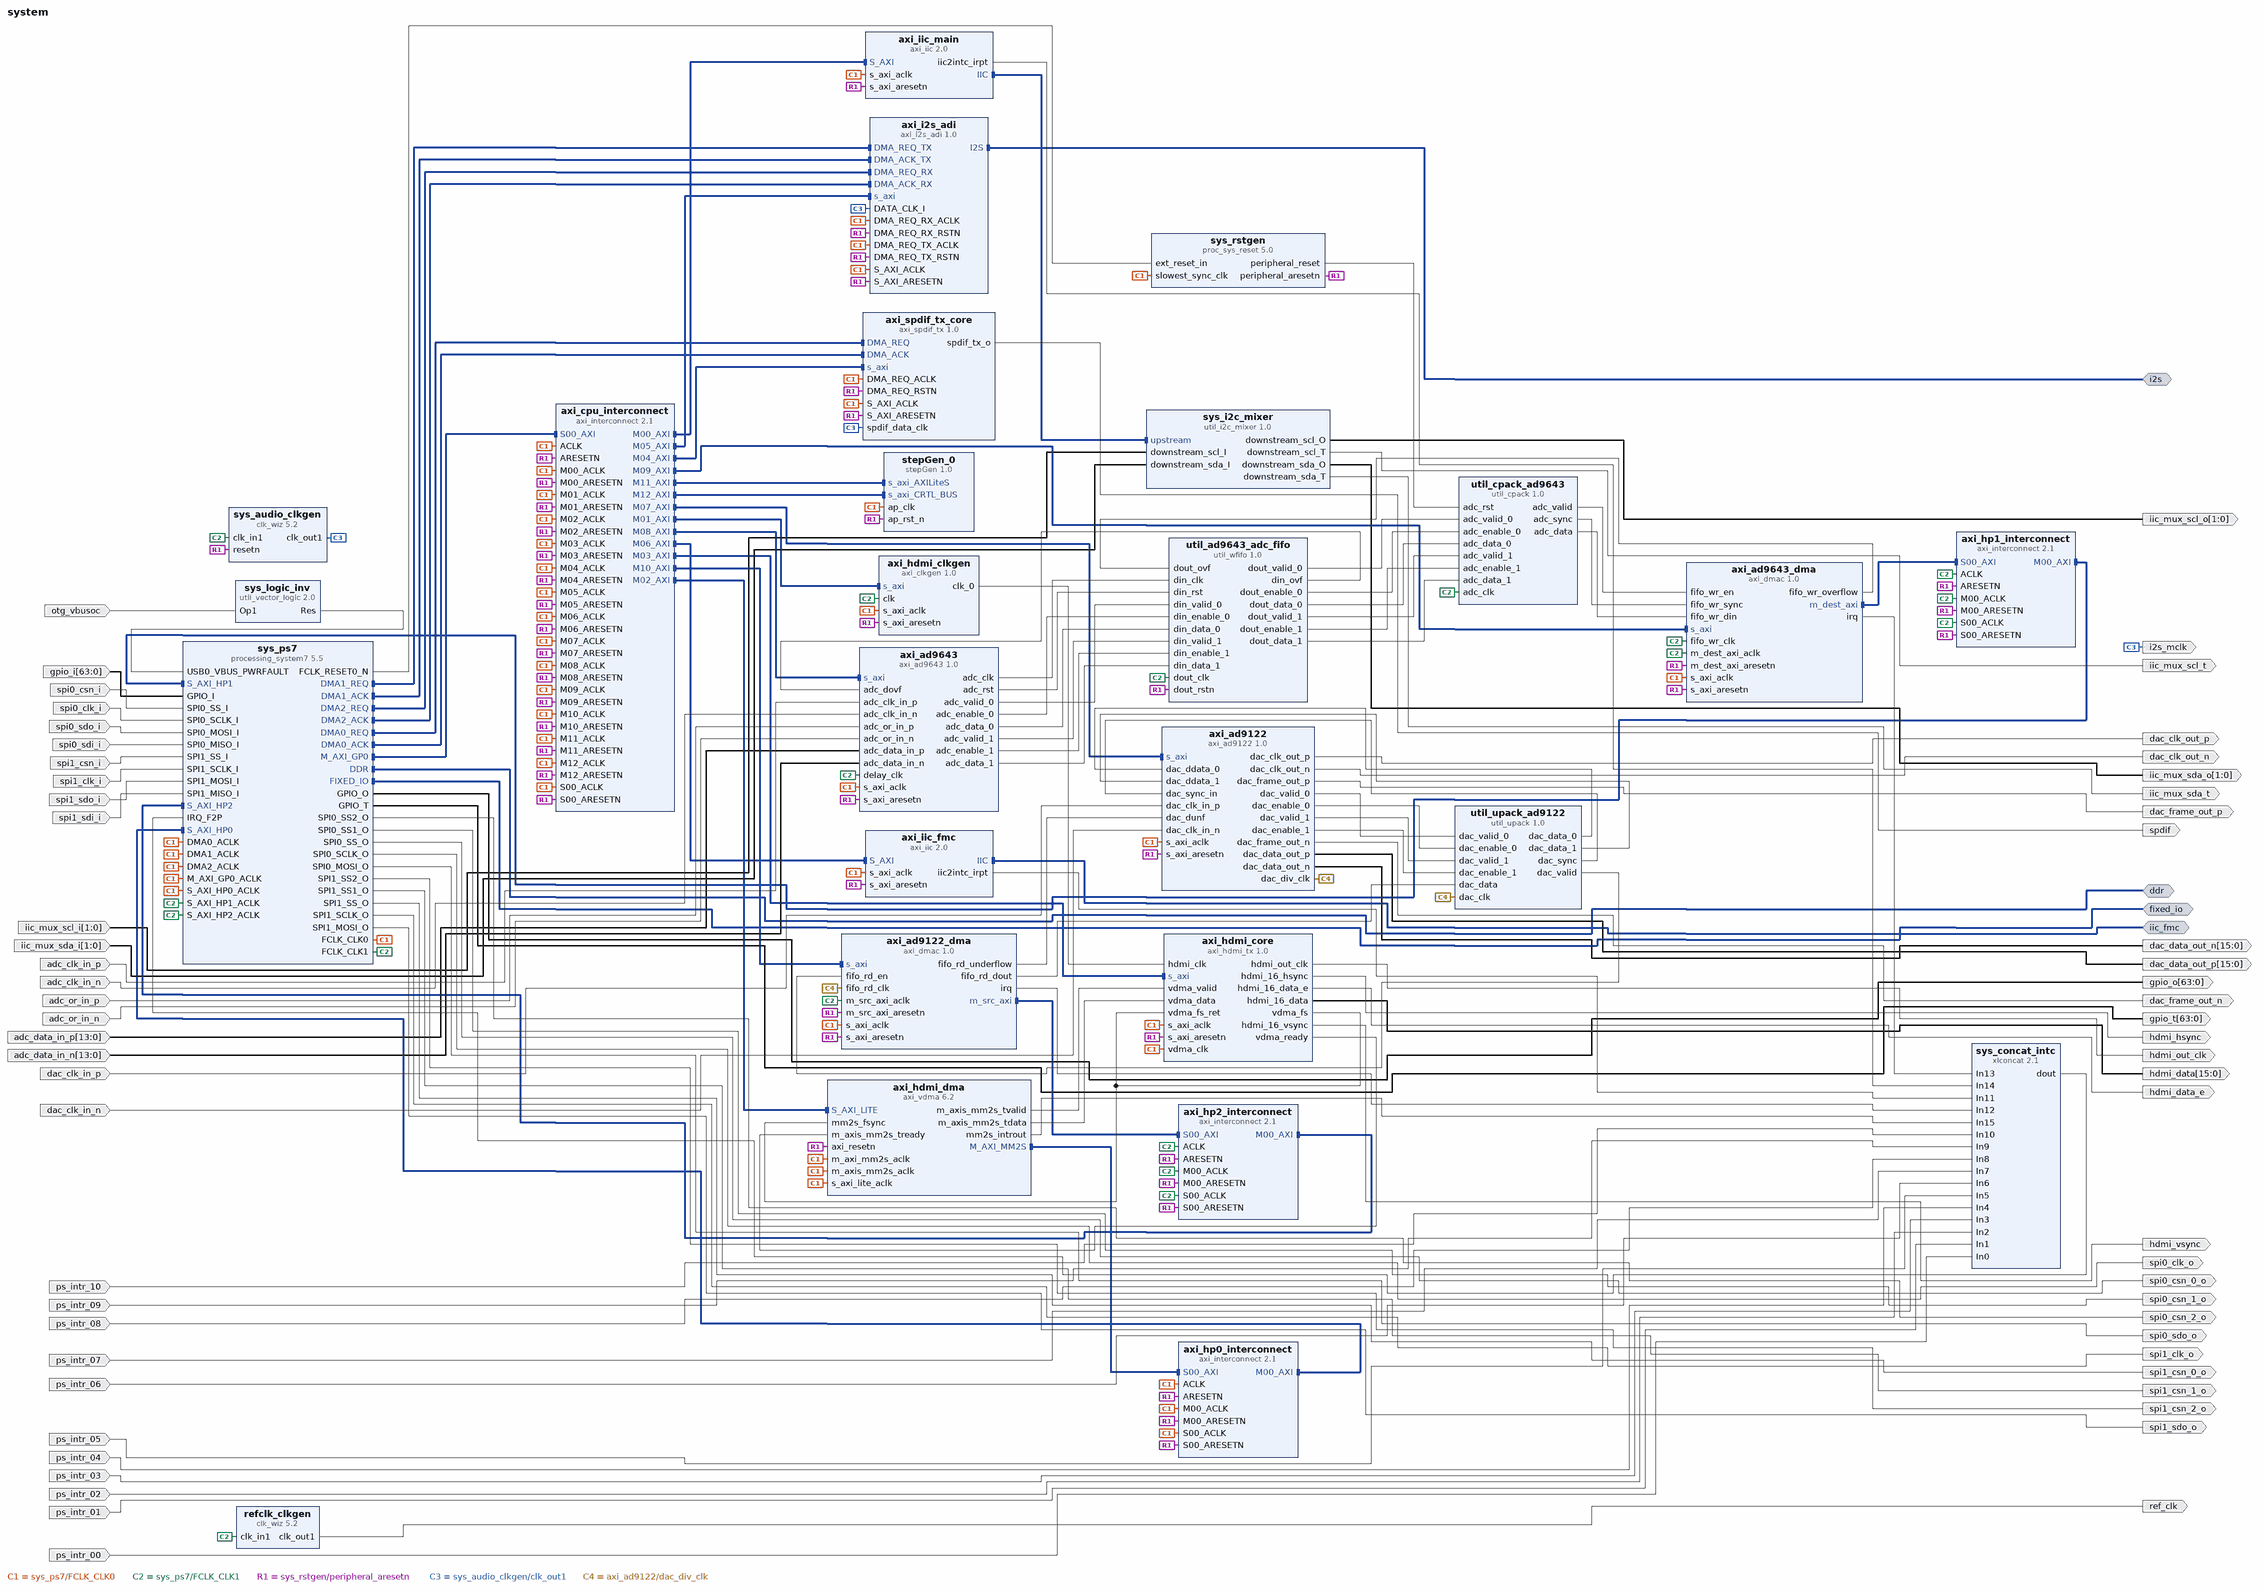
[diagram p0: block diagram of the top level]
# Vivado block design system, Vivado 2015.4.2
create_bd_design system

create_bd_intf_port -mode Master -vlnv xilinx.com:interface:ddrx_rtl:1.0 ddr
create_bd_intf_port -mode Master -vlnv xilinx.com:display_processing_system7:fixedio_rtl:1.0 fixed_io
create_bd_intf_port -mode Master -vlnv xilinx.com:interface:iic_rtl:1.0 iic_fmc
create_bd_intf_port -mode Master -vlnv analog.com:interface:i2s_rtl:1.0 i2s
create_bd_port -dir I -from 63 -to 0 gpio_i
create_bd_port -dir O -from 63 -to 0 gpio_o
create_bd_port -dir O -from 63 -to 0 gpio_t
create_bd_port -dir I -from 1 -to 0 iic_mux_scl_i
create_bd_port -dir O -from 1 -to 0 iic_mux_scl_o
create_bd_port -dir O iic_mux_scl_t
create_bd_port -dir I -from 1 -to 0 iic_mux_sda_i
create_bd_port -dir O -from 1 -to 0 iic_mux_sda_o
create_bd_port -dir O iic_mux_sda_t
create_bd_port -dir I otg_vbusoc
create_bd_port -dir O spi0_csn_2_o
create_bd_port -dir O spi0_csn_1_o
create_bd_port -dir O spi0_csn_0_o
create_bd_port -dir I spi0_csn_i
create_bd_port -dir I spi0_clk_i
create_bd_port -dir O spi0_clk_o
create_bd_port -dir I spi0_sdo_i
create_bd_port -dir O spi0_sdo_o
create_bd_port -dir I spi0_sdi_i
create_bd_port -dir O spi1_csn_2_o
create_bd_port -dir O spi1_csn_1_o
create_bd_port -dir O spi1_csn_0_o
create_bd_port -dir I spi1_csn_i
create_bd_port -dir I spi1_clk_i
create_bd_port -dir O spi1_clk_o
create_bd_port -dir I spi1_sdo_i
create_bd_port -dir O spi1_sdo_o
create_bd_port -dir I spi1_sdi_i
create_bd_port -dir O hdmi_out_clk
create_bd_port -dir O hdmi_hsync
create_bd_port -dir O hdmi_vsync
create_bd_port -dir O hdmi_data_e
create_bd_port -dir O -from 15 -to 0 hdmi_data
create_bd_port -dir O -type clk i2s_mclk
create_bd_port -dir O spdif
create_bd_port -dir I -type intr ps_intr_10
create_bd_port -dir I -type intr ps_intr_09
create_bd_port -dir I -type intr ps_intr_08
create_bd_port -dir I -type intr ps_intr_07
create_bd_port -dir I -type intr ps_intr_06
create_bd_port -dir I -type intr ps_intr_05
create_bd_port -dir I -type intr ps_intr_04
create_bd_port -dir I -type intr ps_intr_03
create_bd_port -dir I -type intr ps_intr_02
create_bd_port -dir I -type intr ps_intr_01
create_bd_port -dir I -type intr ps_intr_00
create_bd_port -dir O ref_clk
create_bd_port -dir I dac_clk_in_p
create_bd_port -dir I dac_clk_in_n
create_bd_port -dir O dac_clk_out_p
create_bd_port -dir O dac_clk_out_n
create_bd_port -dir O dac_frame_out_p
create_bd_port -dir O dac_frame_out_n
create_bd_port -dir O -from 15 -to 0 dac_data_out_p
create_bd_port -dir O -from 15 -to 0 dac_data_out_n
create_bd_port -dir I adc_clk_in_p
create_bd_port -dir I adc_clk_in_n
create_bd_port -dir I adc_or_in_p
create_bd_port -dir I adc_or_in_n
create_bd_port -dir I -from 13 -to 0 adc_data_in_p
create_bd_port -dir I -from 13 -to 0 adc_data_in_n

create_bd_cell -type ip -vlnv xilinx.com:ip:processing_system7:5.5 sys_ps7
set_property -dict [list \
  CONFIG.PCW_FPGA0_PERIPHERAL_FREQMHZ 100.0 \
  CONFIG.PCW_FPGA1_PERIPHERAL_FREQMHZ 200.0 \
  CONFIG.PCW_USE_S_AXI_HP0 1 \
  CONFIG.PCW_USE_S_AXI_HP1 1 \
  CONFIG.PCW_USE_S_AXI_HP2 1 \
  CONFIG.PCW_USE_DMA0 1 \
  CONFIG.PCW_USE_DMA1 1 \
  CONFIG.PCW_USE_DMA2 1 \
  CONFIG.PCW_USE_FABRIC_INTERRUPT 1 \
  CONFIG.PCW_EN_CLK1_PORT 1 \
  CONFIG.PCW_EN_RST1_PORT 1 \
  CONFIG.PCW_IRQ_F2P_INTR 1 \
  CONFIG.PCW_IRQ_F2P_MODE REVERSE \
  CONFIG.PCW_IMPORT_BOARD_PRESET ZedBoard \
  CONFIG.PCW_SPI0_PERIPHERAL_ENABLE 1 \
  CONFIG.PCW_SPI0_SPI0_IO EMIO \
  CONFIG.PCW_SPI1_PERIPHERAL_ENABLE 1 \
  CONFIG.PCW_SPI1_SPI1_IO EMIO \
  CONFIG.PCW_GPIO_EMIO_GPIO_ENABLE 1 \
  CONFIG.PCW_GPIO_EMIO_GPIO_IO 64 \
] [get_bd_cells sys_ps7]
# 1 more settings of sys_ps7 are not shown: defaults, MIO pin electricals, DDR timing, and values the tool derives
create_bd_cell -type ip -vlnv xilinx.com:ip:axi_iic:2.0 axi_iic_main
set_property -dict {CONFIG.USE_BOARD_FLOW true CONFIG.IIC_BOARD_INTERFACE Custom} [get_bd_cells axi_iic_main]
create_bd_cell -type ip -vlnv analog.com:user:util_i2c_mixer:1.0 sys_i2c_mixer
create_bd_cell -type ip -vlnv xilinx.com:ip:xlconcat:2.1 sys_concat_intc
set_property -dict {CONFIG.NUM_PORTS 16} [get_bd_cells sys_concat_intc]
create_bd_cell -type ip -vlnv xilinx.com:ip:proc_sys_reset:5.0 sys_rstgen
set_property -dict {CONFIG.C_EXT_RST_WIDTH 1} [get_bd_cells sys_rstgen]
create_bd_cell -type ip -vlnv xilinx.com:ip:util_vector_logic:2.0 sys_logic_inv
set_property -dict {CONFIG.C_SIZE 1 CONFIG.C_OPERATION not} [get_bd_cells sys_logic_inv]
create_bd_cell -type ip -vlnv analog.com:user:axi_clkgen:1.0 axi_hdmi_clkgen
create_bd_cell -type ip -vlnv analog.com:user:axi_hdmi_tx:1.0 axi_hdmi_core
create_bd_cell -type ip -vlnv xilinx.com:ip:axi_vdma:6.2 axi_hdmi_dma
set_property -dict [list \
  CONFIG.c_m_axis_mm2s_tdata_width 64 \
  CONFIG.c_use_mm2s_fsync 1 \
  CONFIG.c_include_s2mm 0 \
] [get_bd_cells axi_hdmi_dma]
create_bd_cell -type ip -vlnv xilinx.com:ip:clk_wiz:5.2 sys_audio_clkgen
set_property -dict [list \
  CONFIG.PRIM_IN_FREQ 200.000 \
  CONFIG.CLKOUT1_REQUESTED_OUT_FREQ 12.288 \
  CONFIG.USE_LOCKED false \
  CONFIG.USE_RESET true \
  CONFIG.RESET_TYPE ACTIVE_LOW \
] [get_bd_cells sys_audio_clkgen]
create_bd_cell -type ip -vlnv analog.com:user:axi_spdif_tx:1.0 axi_spdif_tx_core
set_property -dict {CONFIG.S_AXI_ADDRESS_WIDTH 16 CONFIG.DMA_TYPE 1} [get_bd_cells axi_spdif_tx_core]
create_bd_cell -type ip -vlnv analog.com:user:axi_i2s_adi:1.0 axi_i2s_adi
set_property -dict {CONFIG.S_AXI_ADDRESS_WIDTH 16 CONFIG.DMA_TYPE 1} [get_bd_cells axi_i2s_adi]
create_bd_cell -type ip -vlnv xilinx.com:ip:axi_iic:2.0 axi_iic_fmc
create_bd_cell -type ip -vlnv xilinx.com:ip:axi_interconnect:2.1 axi_cpu_interconnect
set_property -dict {CONFIG.NUM_MI 13} [get_bd_cells axi_cpu_interconnect]
create_bd_cell -type ip -vlnv xilinx.com:ip:axi_interconnect:2.1 axi_hp0_interconnect
set_property -dict {CONFIG.NUM_SI 1 CONFIG.NUM_MI 1} [get_bd_cells axi_hp0_interconnect]
create_bd_cell -type ip -vlnv analog.com:user:axi_ad9122:1.0 axi_ad9122
create_bd_cell -type ip -vlnv analog.com:user:axi_dmac:1.0 axi_ad9122_dma
set_property -dict [list \
  CONFIG.DMA_DATA_WIDTH_DEST 128 \
  CONFIG.DMA_2D_TRANSFER false \
  CONFIG.AXI_SLICE_DEST true \
  CONFIG.AXI_SLICE_SRC true \
  CONFIG.CYCLIC true \
  CONFIG.DMA_TYPE_DEST 2 \
  CONFIG.DMA_TYPE_SRC 0 \
  CONFIG.FIFO_SIZE 16 \
] [get_bd_cells axi_ad9122_dma]
create_bd_cell -type ip -vlnv analog.com:user:util_upack:1.0 util_upack_ad9122
set_property -dict {CONFIG.CHANNEL_DATA_WIDTH 64 CONFIG.NUM_OF_CHANNELS 2} [get_bd_cells util_upack_ad9122]
create_bd_cell -type ip -vlnv analog.com:user:axi_ad9643:1.0 axi_ad9643
create_bd_cell -type ip -vlnv analog.com:user:axi_dmac:1.0 axi_ad9643_dma
set_property -dict [list \
  CONFIG.DMA_DATA_WIDTH_DEST 64 \
  CONFIG.DMA_2D_TRANSFER false \
  CONFIG.AXI_SLICE_DEST true \
  CONFIG.AXI_SLICE_SRC true \
  CONFIG.SYNC_TRANSFER_START true \
  CONFIG.CYCLIC false \
  CONFIG.DMA_TYPE_DEST 0 \
  CONFIG.DMA_TYPE_SRC 2 \
  CONFIG.FIFO_SIZE 16 \
] [get_bd_cells axi_ad9643_dma]
create_bd_cell -type ip -vlnv analog.com:user:util_cpack:1.0 util_cpack_ad9643
set_property -dict {CONFIG.CHANNEL_DATA_WIDTH 32 CONFIG.NUM_OF_CHANNELS 2} [get_bd_cells util_cpack_ad9643]
create_bd_cell -type ip -vlnv analog.com:user:util_wfifo:1.0 util_ad9643_adc_fifo
set_property -dict [list \
  CONFIG.NUM_OF_CHANNELS 2 \
  CONFIG.DIN_DATA_WIDTH 16 \
  CONFIG.DOUT_DATA_WIDTH 32 \
  CONFIG.DIN_ADDRESS_WIDTH 4 \
] [get_bd_cells util_ad9643_adc_fifo]
create_bd_cell -type ip -vlnv xilinx.com:ip:clk_wiz:5.2 refclk_clkgen
set_property -dict [list \
  CONFIG.USE_PHASE_ALIGNMENT false \
  CONFIG.JITTER_SEL Min_O_Jitter \
  CONFIG.CLKOUT1_REQUESTED_OUT_FREQ 30 \
  CONFIG.USE_LOCKED false \
  CONFIG.USE_RESET false \
] [get_bd_cells refclk_clkgen]
create_bd_cell -type ip -vlnv xilinx.com:ip:axi_interconnect:2.1 axi_hp1_interconnect
set_property -dict {CONFIG.NUM_SI 1 CONFIG.NUM_MI 1} [get_bd_cells axi_hp1_interconnect]
create_bd_cell -type ip -vlnv xilinx.com:ip:axi_interconnect:2.1 axi_hp2_interconnect
set_property -dict {CONFIG.NUM_SI 1 CONFIG.NUM_MI 1} [get_bd_cells axi_hp2_interconnect]
create_bd_cell -type ip -vlnv xilinx.com:hls:stepGen:1.0 stepGen_0

# ---- connections ----

connect_bd_intf_net [get_bd_intf_pins axi_iic_main/IIC] [get_bd_intf_pins sys_i2c_mixer/upstream]
connect_bd_intf_net [get_bd_intf_pins sys_ps7/DMA0_REQ] [get_bd_intf_pins axi_spdif_tx_core/DMA_REQ]
connect_bd_intf_net [get_bd_intf_pins sys_ps7/DMA0_ACK] [get_bd_intf_pins axi_spdif_tx_core/DMA_ACK]
connect_bd_intf_net [get_bd_intf_pins sys_ps7/DMA1_REQ] [get_bd_intf_pins axi_i2s_adi/DMA_REQ_TX]
connect_bd_intf_net [get_bd_intf_pins sys_ps7/DMA1_ACK] [get_bd_intf_pins axi_i2s_adi/DMA_ACK_TX]
connect_bd_intf_net [get_bd_intf_pins sys_ps7/DMA2_REQ] [get_bd_intf_pins axi_i2s_adi/DMA_REQ_RX]
connect_bd_intf_net [get_bd_intf_pins sys_ps7/DMA2_ACK] [get_bd_intf_pins axi_i2s_adi/DMA_ACK_RX]
connect_bd_intf_net [get_bd_intf_pins axi_cpu_interconnect/S00_AXI] [get_bd_intf_pins sys_ps7/M_AXI_GP0]
connect_bd_intf_net [get_bd_intf_pins axi_cpu_interconnect/M00_AXI] [get_bd_intf_pins axi_iic_main/S_AXI]
connect_bd_intf_net [get_bd_intf_pins axi_cpu_interconnect/M01_AXI] [get_bd_intf_pins axi_hdmi_clkgen/s_axi]
connect_bd_intf_net [get_bd_intf_pins axi_cpu_interconnect/M02_AXI] [get_bd_intf_pins axi_hdmi_dma/S_AXI_LITE]
connect_bd_intf_net [get_bd_intf_pins axi_cpu_interconnect/M03_AXI] [get_bd_intf_pins axi_hdmi_core/s_axi]
connect_bd_intf_net [get_bd_intf_pins axi_cpu_interconnect/M04_AXI] [get_bd_intf_pins axi_spdif_tx_core/s_axi]
connect_bd_intf_net [get_bd_intf_pins axi_cpu_interconnect/M05_AXI] [get_bd_intf_pins axi_i2s_adi/s_axi]
connect_bd_intf_net [get_bd_intf_pins axi_cpu_interconnect/M06_AXI] [get_bd_intf_pins axi_iic_fmc/S_AXI]
connect_bd_intf_net [get_bd_intf_pins axi_hp0_interconnect/M00_AXI] [get_bd_intf_pins sys_ps7/S_AXI_HP0]
connect_bd_intf_net [get_bd_intf_pins axi_hp0_interconnect/S00_AXI] [get_bd_intf_pins axi_hdmi_dma/M_AXI_MM2S]
connect_bd_intf_net [get_bd_intf_pins axi_cpu_interconnect/M07_AXI] [get_bd_intf_pins axi_ad9122/s_axi]
connect_bd_intf_net [get_bd_intf_pins axi_cpu_interconnect/M08_AXI] [get_bd_intf_pins axi_ad9643/s_axi]
connect_bd_intf_net [get_bd_intf_pins axi_cpu_interconnect/M09_AXI] [get_bd_intf_pins axi_ad9643_dma/s_axi]
connect_bd_intf_net [get_bd_intf_pins axi_cpu_interconnect/M10_AXI] [get_bd_intf_pins axi_ad9122_dma/s_axi]
connect_bd_intf_net [get_bd_intf_pins axi_hp1_interconnect/M00_AXI] [get_bd_intf_pins sys_ps7/S_AXI_HP1]
connect_bd_intf_net [get_bd_intf_pins axi_hp1_interconnect/S00_AXI] [get_bd_intf_pins axi_ad9643_dma/m_dest_axi]
connect_bd_intf_net [get_bd_intf_pins axi_hp2_interconnect/M00_AXI] [get_bd_intf_pins sys_ps7/S_AXI_HP2]
connect_bd_intf_net [get_bd_intf_pins axi_hp2_interconnect/S00_AXI] [get_bd_intf_pins axi_ad9122_dma/m_src_axi]
connect_bd_intf_net [get_bd_intf_pins axi_cpu_interconnect/M11_AXI] [get_bd_intf_pins stepGen_0/s_axi_AXILiteS]
connect_bd_intf_net [get_bd_intf_pins axi_cpu_interconnect/M12_AXI] [get_bd_intf_pins stepGen_0/s_axi_CRTL_BUS]
connect_bd_intf_net [get_bd_intf_ports ddr] [get_bd_intf_pins sys_ps7/DDR]
connect_bd_intf_net [get_bd_intf_ports fixed_io] [get_bd_intf_pins sys_ps7/FIXED_IO]
connect_bd_intf_net [get_bd_intf_ports iic_fmc] [get_bd_intf_pins axi_iic_fmc/IIC]
connect_bd_intf_net [get_bd_intf_ports i2s] [get_bd_intf_pins axi_i2s_adi/I2S]
connect_bd_net -net sys_cpu_clk [get_bd_pins sys_ps7/FCLK_CLK0] \
  [get_bd_pins sys_rstgen/slowest_sync_clk] [get_bd_pins axi_hdmi_core/vdma_clk] [get_bd_pins axi_hdmi_dma/m_axis_mm2s_aclk] \
  [get_bd_pins axi_spdif_tx_core/DMA_REQ_ACLK] [get_bd_pins sys_ps7/DMA0_ACLK] [get_bd_pins axi_i2s_adi/DMA_REQ_RX_ACLK] \
  [get_bd_pins axi_i2s_adi/DMA_REQ_TX_ACLK] [get_bd_pins sys_ps7/DMA1_ACLK] [get_bd_pins sys_ps7/DMA2_ACLK] \
  [get_bd_pins sys_ps7/M_AXI_GP0_ACLK] [get_bd_pins axi_iic_main/s_axi_aclk] [get_bd_pins axi_hdmi_clkgen/s_axi_aclk] \
  [get_bd_pins axi_hdmi_dma/s_axi_lite_aclk] [get_bd_pins axi_hdmi_core/s_axi_aclk] \
  [get_bd_pins axi_spdif_tx_core/S_AXI_ACLK] [get_bd_pins axi_i2s_adi/S_AXI_ACLK] [get_bd_pins axi_iic_fmc/s_axi_aclk] \
  [get_bd_pins sys_ps7/S_AXI_HP0_ACLK] [get_bd_pins axi_hdmi_dma/m_axi_mm2s_aclk] [get_bd_pins axi_ad9122/s_axi_aclk] \
  [get_bd_pins axi_ad9643/s_axi_aclk] [get_bd_pins axi_ad9643_dma/s_axi_aclk] [get_bd_pins axi_ad9122_dma/s_axi_aclk] \
  [get_bd_pins axi_cpu_interconnect/ACLK] [get_bd_pins axi_cpu_interconnect/S00_ACLK] \
  [get_bd_pins axi_cpu_interconnect/M00_ACLK] [get_bd_pins axi_cpu_interconnect/M01_ACLK] \
  [get_bd_pins axi_cpu_interconnect/M02_ACLK] [get_bd_pins axi_cpu_interconnect/M03_ACLK] \
  [get_bd_pins axi_cpu_interconnect/M04_ACLK] [get_bd_pins axi_cpu_interconnect/M05_ACLK] \
  [get_bd_pins axi_cpu_interconnect/M06_ACLK] [get_bd_pins axi_hp0_interconnect/ACLK] \
  [get_bd_pins axi_hp0_interconnect/M00_ACLK] [get_bd_pins axi_hp0_interconnect/S00_ACLK] \
  [get_bd_pins axi_cpu_interconnect/M07_ACLK] [get_bd_pins axi_cpu_interconnect/M08_ACLK] \
  [get_bd_pins axi_cpu_interconnect/M09_ACLK] [get_bd_pins axi_cpu_interconnect/M10_ACLK] [get_bd_pins stepGen_0/ap_clk] \
  [get_bd_pins axi_cpu_interconnect/M11_ACLK] [get_bd_pins axi_cpu_interconnect/M12_ACLK]
connect_bd_net -net sys_200m_clk [get_bd_pins sys_ps7/FCLK_CLK1] \
  [get_bd_pins axi_hdmi_clkgen/clk] [get_bd_pins sys_audio_clkgen/clk_in1] [get_bd_pins refclk_clkgen/clk_in1] \
  [get_bd_pins util_cpack_ad9643/adc_clk] [get_bd_pins axi_ad9643/delay_clk] [get_bd_pins axi_ad9643_dma/fifo_wr_clk] \
  [get_bd_pins util_ad9643_adc_fifo/dout_clk] [get_bd_pins sys_ps7/S_AXI_HP1_ACLK] \
  [get_bd_pins axi_ad9643_dma/m_dest_axi_aclk] [get_bd_pins sys_ps7/S_AXI_HP2_ACLK] \
  [get_bd_pins axi_ad9122_dma/m_src_axi_aclk] [get_bd_pins axi_hp1_interconnect/ACLK] \
  [get_bd_pins axi_hp1_interconnect/M00_ACLK] [get_bd_pins axi_hp1_interconnect/S00_ACLK] \
  [get_bd_pins axi_hp2_interconnect/ACLK] [get_bd_pins axi_hp2_interconnect/M00_ACLK] \
  [get_bd_pins axi_hp2_interconnect/S00_ACLK]
connect_bd_net -net sys_cpu_reset [get_bd_pins sys_rstgen/peripheral_reset] [get_bd_pins util_cpack_ad9643/adc_rst]
connect_bd_net -net sys_cpu_resetn [get_bd_pins sys_rstgen/peripheral_aresetn] \
  [get_bd_pins axi_spdif_tx_core/DMA_REQ_RSTN] [get_bd_pins sys_audio_clkgen/resetn] \
  [get_bd_pins axi_i2s_adi/DMA_REQ_TX_RSTN] [get_bd_pins axi_i2s_adi/DMA_REQ_RX_RSTN] \
  [get_bd_pins axi_iic_main/s_axi_aresetn] [get_bd_pins axi_hdmi_clkgen/s_axi_aresetn] [get_bd_pins axi_hdmi_dma/axi_resetn] \
  [get_bd_pins axi_hdmi_core/s_axi_aresetn] [get_bd_pins axi_spdif_tx_core/S_AXI_ARESETN] \
  [get_bd_pins axi_i2s_adi/S_AXI_ARESETN] [get_bd_pins axi_iic_fmc/s_axi_aresetn] \
  [get_bd_pins util_ad9643_adc_fifo/dout_rstn] [get_bd_pins axi_ad9122_dma/m_src_axi_aresetn] \
  [get_bd_pins axi_ad9643_dma/m_dest_axi_aresetn] [get_bd_pins axi_ad9122/s_axi_aresetn] \
  [get_bd_pins axi_ad9643/s_axi_aresetn] [get_bd_pins axi_ad9643_dma/s_axi_aresetn] \
  [get_bd_pins axi_ad9122_dma/s_axi_aresetn] [get_bd_pins axi_cpu_interconnect/ARESETN] \
  [get_bd_pins axi_cpu_interconnect/S00_ARESETN] [get_bd_pins axi_cpu_interconnect/M00_ARESETN] \
  [get_bd_pins axi_cpu_interconnect/M01_ARESETN] [get_bd_pins axi_cpu_interconnect/M02_ARESETN] \
  [get_bd_pins axi_cpu_interconnect/M03_ARESETN] [get_bd_pins axi_cpu_interconnect/M04_ARESETN] \
  [get_bd_pins axi_cpu_interconnect/M05_ARESETN] [get_bd_pins axi_cpu_interconnect/M06_ARESETN] \
  [get_bd_pins axi_hp0_interconnect/ARESETN] [get_bd_pins axi_hp0_interconnect/M00_ARESETN] \
  [get_bd_pins axi_hp0_interconnect/S00_ARESETN] [get_bd_pins axi_cpu_interconnect/M07_ARESETN] \
  [get_bd_pins axi_cpu_interconnect/M08_ARESETN] [get_bd_pins axi_cpu_interconnect/M09_ARESETN] \
  [get_bd_pins axi_cpu_interconnect/M10_ARESETN] [get_bd_pins axi_hp1_interconnect/ARESETN] \
  [get_bd_pins axi_hp1_interconnect/M00_ARESETN] [get_bd_pins axi_hp1_interconnect/S00_ARESETN] \
  [get_bd_pins axi_hp2_interconnect/ARESETN] [get_bd_pins axi_hp2_interconnect/M00_ARESETN] \
  [get_bd_pins axi_hp2_interconnect/S00_ARESETN] [get_bd_pins stepGen_0/ap_rst_n] \
  [get_bd_pins axi_cpu_interconnect/M11_ARESETN] [get_bd_pins axi_cpu_interconnect/M12_ARESETN]
connect_bd_net [get_bd_pins sys_ps7/FCLK_RESET0_N] [get_bd_pins sys_rstgen/ext_reset_in]
connect_bd_net [get_bd_ports gpio_i] [get_bd_pins sys_ps7/GPIO_I]
connect_bd_net [get_bd_pins sys_ps7/GPIO_O] [get_bd_ports gpio_o]
connect_bd_net [get_bd_pins sys_ps7/GPIO_T] [get_bd_ports gpio_t]
connect_bd_net [get_bd_ports iic_mux_scl_i] [get_bd_pins sys_i2c_mixer/downstream_scl_I]
connect_bd_net [get_bd_pins sys_i2c_mixer/downstream_scl_O] [get_bd_ports iic_mux_scl_o]
connect_bd_net [get_bd_pins sys_i2c_mixer/downstream_scl_T] [get_bd_ports iic_mux_scl_t]
connect_bd_net [get_bd_ports iic_mux_sda_i] [get_bd_pins sys_i2c_mixer/downstream_sda_I]
connect_bd_net [get_bd_pins sys_i2c_mixer/downstream_sda_O] [get_bd_ports iic_mux_sda_o]
connect_bd_net [get_bd_pins sys_i2c_mixer/downstream_sda_T] [get_bd_ports iic_mux_sda_t]
connect_bd_net [get_bd_pins sys_logic_inv/Res] [get_bd_pins sys_ps7/USB0_VBUS_PWRFAULT]
connect_bd_net [get_bd_ports otg_vbusoc] [get_bd_pins sys_logic_inv/Op1]
connect_bd_net [get_bd_pins sys_ps7/SPI0_SS2_O] [get_bd_ports spi0_csn_2_o]
connect_bd_net [get_bd_pins sys_ps7/SPI0_SS1_O] [get_bd_ports spi0_csn_1_o]
connect_bd_net [get_bd_pins sys_ps7/SPI0_SS_O] [get_bd_ports spi0_csn_0_o]
connect_bd_net [get_bd_ports spi0_csn_i] [get_bd_pins sys_ps7/SPI0_SS_I]
connect_bd_net [get_bd_ports spi0_clk_i] [get_bd_pins sys_ps7/SPI0_SCLK_I]
connect_bd_net [get_bd_pins sys_ps7/SPI0_SCLK_O] [get_bd_ports spi0_clk_o]
connect_bd_net [get_bd_ports spi0_sdo_i] [get_bd_pins sys_ps7/SPI0_MOSI_I]
connect_bd_net [get_bd_pins sys_ps7/SPI0_MOSI_O] [get_bd_ports spi0_sdo_o]
connect_bd_net [get_bd_ports spi0_sdi_i] [get_bd_pins sys_ps7/SPI0_MISO_I]
connect_bd_net [get_bd_pins sys_ps7/SPI1_SS2_O] [get_bd_ports spi1_csn_2_o]
connect_bd_net [get_bd_pins sys_ps7/SPI1_SS1_O] [get_bd_ports spi1_csn_1_o]
connect_bd_net [get_bd_pins sys_ps7/SPI1_SS_O] [get_bd_ports spi1_csn_0_o]
connect_bd_net [get_bd_ports spi1_csn_i] [get_bd_pins sys_ps7/SPI1_SS_I]
connect_bd_net [get_bd_ports spi1_clk_i] [get_bd_pins sys_ps7/SPI1_SCLK_I]
connect_bd_net [get_bd_pins sys_ps7/SPI1_SCLK_O] [get_bd_ports spi1_clk_o]
connect_bd_net [get_bd_ports spi1_sdo_i] [get_bd_pins sys_ps7/SPI1_MOSI_I]
connect_bd_net [get_bd_pins sys_ps7/SPI1_MOSI_O] [get_bd_ports spi1_sdo_o]
connect_bd_net [get_bd_ports spi1_sdi_i] [get_bd_pins sys_ps7/SPI1_MISO_I]
connect_bd_net [get_bd_pins axi_hdmi_clkgen/clk_0] [get_bd_pins axi_hdmi_core/hdmi_clk]
connect_bd_net [get_bd_pins axi_hdmi_core/hdmi_out_clk] [get_bd_ports hdmi_out_clk]
connect_bd_net [get_bd_pins axi_hdmi_core/hdmi_16_hsync] [get_bd_ports hdmi_hsync]
connect_bd_net [get_bd_pins axi_hdmi_core/hdmi_16_vsync] [get_bd_ports hdmi_vsync]
connect_bd_net [get_bd_pins axi_hdmi_core/hdmi_16_data_e] [get_bd_ports hdmi_data_e]
connect_bd_net [get_bd_pins axi_hdmi_core/hdmi_16_data] [get_bd_ports hdmi_data]
connect_bd_net [get_bd_pins axi_hdmi_dma/m_axis_mm2s_tvalid] [get_bd_pins axi_hdmi_core/vdma_valid]
connect_bd_net [get_bd_pins axi_hdmi_dma/m_axis_mm2s_tdata] [get_bd_pins axi_hdmi_core/vdma_data]
connect_bd_net [get_bd_pins axi_hdmi_core/vdma_ready] [get_bd_pins axi_hdmi_dma/m_axis_mm2s_tready]
connect_bd_net [get_bd_pins axi_hdmi_core/vdma_fs] [get_bd_pins axi_hdmi_dma/mm2s_fsync] [get_bd_pins axi_hdmi_core/vdma_fs_ret]
connect_bd_net [get_bd_pins sys_audio_clkgen/clk_out1] \
  [get_bd_ports i2s_mclk] [get_bd_pins axi_spdif_tx_core/spdif_data_clk] [get_bd_pins axi_i2s_adi/DATA_CLK_I]
connect_bd_net [get_bd_pins axi_spdif_tx_core/spdif_tx_o] [get_bd_ports spdif]
connect_bd_net [get_bd_pins sys_concat_intc/dout] [get_bd_pins sys_ps7/IRQ_F2P]
connect_bd_net [get_bd_pins axi_hdmi_dma/mm2s_introut] [get_bd_pins sys_concat_intc/In15]
connect_bd_net [get_bd_pins axi_iic_main/iic2intc_irpt] [get_bd_pins sys_concat_intc/In14]
connect_bd_net [get_bd_pins axi_iic_fmc/iic2intc_irpt] [get_bd_pins sys_concat_intc/In11]
connect_bd_net -net ps_intr_10_1 [get_bd_ports ps_intr_10] [get_bd_pins sys_concat_intc/In10]
connect_bd_net -net ps_intr_09_1 [get_bd_ports ps_intr_09] [get_bd_pins sys_concat_intc/In9]
connect_bd_net -net ps_intr_08_1 [get_bd_ports ps_intr_08] [get_bd_pins sys_concat_intc/In8]
connect_bd_net -net ps_intr_07_1 [get_bd_ports ps_intr_07] [get_bd_pins sys_concat_intc/In7]
connect_bd_net -net ps_intr_06_1 [get_bd_ports ps_intr_06] [get_bd_pins sys_concat_intc/In6]
connect_bd_net -net ps_intr_05_1 [get_bd_ports ps_intr_05] [get_bd_pins sys_concat_intc/In5]
connect_bd_net -net ps_intr_04_1 [get_bd_ports ps_intr_04] [get_bd_pins sys_concat_intc/In4]
connect_bd_net -net ps_intr_03_1 [get_bd_ports ps_intr_03] [get_bd_pins sys_concat_intc/In3]
connect_bd_net -net ps_intr_02_1 [get_bd_ports ps_intr_02] [get_bd_pins sys_concat_intc/In2]
connect_bd_net -net ps_intr_01_1 [get_bd_ports ps_intr_01] [get_bd_pins sys_concat_intc/In1]
connect_bd_net -net ps_intr_00_1 [get_bd_ports ps_intr_00] [get_bd_pins sys_concat_intc/In0]
connect_bd_net [get_bd_pins refclk_clkgen/clk_out1] [get_bd_ports ref_clk]
connect_bd_net -net dac_clk [get_bd_pins axi_ad9122/dac_div_clk] [get_bd_pins axi_ad9122_dma/fifo_rd_clk] [get_bd_pins util_upack_ad9122/dac_clk]
connect_bd_net [get_bd_ports dac_clk_in_p] [get_bd_pins axi_ad9122/dac_clk_in_p]
connect_bd_net [get_bd_ports dac_clk_in_n] [get_bd_pins axi_ad9122/dac_clk_in_n]
connect_bd_net [get_bd_pins axi_ad9122/dac_clk_out_p] [get_bd_ports dac_clk_out_p]
connect_bd_net [get_bd_pins axi_ad9122/dac_clk_out_n] [get_bd_ports dac_clk_out_n]
connect_bd_net [get_bd_pins axi_ad9122/dac_frame_out_p] [get_bd_ports dac_frame_out_p]
connect_bd_net [get_bd_pins axi_ad9122/dac_frame_out_n] [get_bd_ports dac_frame_out_n]
connect_bd_net [get_bd_pins axi_ad9122/dac_data_out_p] [get_bd_ports dac_data_out_p]
connect_bd_net [get_bd_pins axi_ad9122/dac_data_out_n] [get_bd_ports dac_data_out_n]
connect_bd_net [get_bd_pins axi_ad9122/dac_valid_0] [get_bd_pins util_upack_ad9122/dac_valid_0]
connect_bd_net [get_bd_pins axi_ad9122/dac_enable_0] [get_bd_pins util_upack_ad9122/dac_enable_0]
connect_bd_net [get_bd_pins util_upack_ad9122/dac_data_0] [get_bd_pins axi_ad9122/dac_ddata_0]
connect_bd_net [get_bd_pins axi_ad9122/dac_valid_1] [get_bd_pins util_upack_ad9122/dac_valid_1]
connect_bd_net [get_bd_pins axi_ad9122/dac_enable_1] [get_bd_pins util_upack_ad9122/dac_enable_1]
connect_bd_net [get_bd_pins util_upack_ad9122/dac_data_1] [get_bd_pins axi_ad9122/dac_ddata_1]
connect_bd_net [get_bd_pins axi_ad9122_dma/fifo_rd_underflow] [get_bd_pins axi_ad9122/dac_dunf]
connect_bd_net [get_bd_pins util_upack_ad9122/dac_valid] [get_bd_pins axi_ad9122_dma/fifo_rd_en]
connect_bd_net [get_bd_pins axi_ad9122_dma/fifo_rd_dout] [get_bd_pins util_upack_ad9122/dac_data]
connect_bd_net [get_bd_pins util_upack_ad9122/dac_sync] [get_bd_pins axi_ad9122/dac_sync_in]
connect_bd_net -net adc_clk [get_bd_pins axi_ad9643/adc_clk] [get_bd_pins util_ad9643_adc_fifo/din_clk]
connect_bd_net -net adc_rst [get_bd_pins axi_ad9643/adc_rst] [get_bd_pins util_ad9643_adc_fifo/din_rst]
connect_bd_net [get_bd_ports adc_clk_in_p] [get_bd_pins axi_ad9643/adc_clk_in_p]
connect_bd_net [get_bd_ports adc_clk_in_n] [get_bd_pins axi_ad9643/adc_clk_in_n]
connect_bd_net [get_bd_ports adc_or_in_p] [get_bd_pins axi_ad9643/adc_or_in_p]
connect_bd_net [get_bd_ports adc_or_in_n] [get_bd_pins axi_ad9643/adc_or_in_n]
connect_bd_net [get_bd_ports adc_data_in_p] [get_bd_pins axi_ad9643/adc_data_in_p]
connect_bd_net [get_bd_ports adc_data_in_n] [get_bd_pins axi_ad9643/adc_data_in_n]
connect_bd_net [get_bd_pins axi_ad9643/adc_valid_0] [get_bd_pins util_ad9643_adc_fifo/din_valid_0]
connect_bd_net [get_bd_pins axi_ad9643/adc_enable_0] [get_bd_pins util_ad9643_adc_fifo/din_enable_0]
connect_bd_net [get_bd_pins axi_ad9643/adc_data_0] [get_bd_pins util_ad9643_adc_fifo/din_data_0]
connect_bd_net [get_bd_pins axi_ad9643/adc_valid_1] [get_bd_pins util_ad9643_adc_fifo/din_valid_1]
connect_bd_net [get_bd_pins axi_ad9643/adc_enable_1] [get_bd_pins util_ad9643_adc_fifo/din_enable_1]
connect_bd_net [get_bd_pins axi_ad9643/adc_data_1] [get_bd_pins util_ad9643_adc_fifo/din_data_1]
connect_bd_net [get_bd_pins util_ad9643_adc_fifo/dout_valid_0] [get_bd_pins util_cpack_ad9643/adc_valid_0]
connect_bd_net [get_bd_pins util_ad9643_adc_fifo/dout_enable_0] [get_bd_pins util_cpack_ad9643/adc_enable_0]
connect_bd_net [get_bd_pins util_ad9643_adc_fifo/dout_data_0] [get_bd_pins util_cpack_ad9643/adc_data_0]
connect_bd_net [get_bd_pins util_ad9643_adc_fifo/dout_valid_1] [get_bd_pins util_cpack_ad9643/adc_valid_1]
connect_bd_net [get_bd_pins util_ad9643_adc_fifo/dout_enable_1] [get_bd_pins util_cpack_ad9643/adc_enable_1]
connect_bd_net [get_bd_pins util_ad9643_adc_fifo/dout_data_1] [get_bd_pins util_cpack_ad9643/adc_data_1]
connect_bd_net [get_bd_pins util_ad9643_adc_fifo/din_ovf] [get_bd_pins axi_ad9643/adc_dovf]
connect_bd_net [get_bd_pins util_cpack_ad9643/adc_valid] [get_bd_pins axi_ad9643_dma/fifo_wr_en]
connect_bd_net [get_bd_pins util_cpack_ad9643/adc_sync] [get_bd_pins axi_ad9643_dma/fifo_wr_sync]
connect_bd_net [get_bd_pins util_cpack_ad9643/adc_data] [get_bd_pins axi_ad9643_dma/fifo_wr_din]
connect_bd_net [get_bd_pins axi_ad9643_dma/fifo_wr_overflow] [get_bd_pins util_ad9643_adc_fifo/dout_ovf]
connect_bd_net [get_bd_pins axi_ad9122_dma/irq] [get_bd_pins sys_concat_intc/In12]
connect_bd_net [get_bd_pins axi_ad9643_dma/irq] [get_bd_pins sys_concat_intc/In13]

# ---- address map ----
assign_bd_address -offset 0x00000000 -range 512M -target_address_space [get_bd_addr_spaces axi_ad9122_dma/m_src_axi] [get_bd_addr_segs sys_ps7/S_AXI_HP2/HP2_DDR_LOWOCM]
assign_bd_address -offset 0x00000000 -range 512M -target_address_space [get_bd_addr_spaces axi_ad9643_dma/m_dest_axi] [get_bd_addr_segs sys_ps7/S_AXI_HP1/HP1_DDR_LOWOCM]
assign_bd_address -offset 0x00000000 -range 512M -target_address_space [get_bd_addr_spaces axi_hdmi_dma/Data_MM2S] [get_bd_addr_segs sys_ps7/S_AXI_HP0/HP0_DDR_LOWOCM]
assign_bd_address -offset 0x41600000 -range 4K -target_address_space [get_bd_addr_spaces sys_ps7/Data] [get_bd_addr_segs axi_iic_main/S_AXI/Reg]
assign_bd_address -offset 0x41620000 -range 4K -target_address_space [get_bd_addr_spaces sys_ps7/Data] [get_bd_addr_segs axi_iic_fmc/S_AXI/Reg]
assign_bd_address -offset 0x43000000 -range 64K -target_address_space [get_bd_addr_spaces sys_ps7/Data] [get_bd_addr_segs axi_hdmi_dma/S_AXI_LITE/Reg]
assign_bd_address -offset 0x43C00000 -range 64K -target_address_space [get_bd_addr_spaces sys_ps7/Data] [get_bd_addr_segs stepGen_0/s_axi_AXILiteS/Reg]
assign_bd_address -offset 0x43C10000 -range 64K -target_address_space [get_bd_addr_spaces sys_ps7/Data] [get_bd_addr_segs stepGen_0/s_axi_CRTL_BUS/Reg]
assign_bd_address -offset 0x70E00000 -range 64K -target_address_space [get_bd_addr_spaces sys_ps7/Data] [get_bd_addr_segs axi_hdmi_core/s_axi/axi_lite]
assign_bd_address -offset 0x74200000 -range 64K -target_address_space [get_bd_addr_spaces sys_ps7/Data] [get_bd_addr_segs axi_ad9122/s_axi/axi_lite]
assign_bd_address -offset 0x75C00000 -range 64K -target_address_space [get_bd_addr_spaces sys_ps7/Data] [get_bd_addr_segs axi_spdif_tx_core/s_axi/axi_lite]
assign_bd_address -offset 0x77600000 -range 64K -target_address_space [get_bd_addr_spaces sys_ps7/Data] [get_bd_addr_segs axi_i2s_adi/s_axi/axi_lite]
assign_bd_address -offset 0x79000000 -range 64K -target_address_space [get_bd_addr_spaces sys_ps7/Data] [get_bd_addr_segs axi_hdmi_clkgen/s_axi/axi_lite]
assign_bd_address -offset 0x79020000 -range 64K -target_address_space [get_bd_addr_spaces sys_ps7/Data] [get_bd_addr_segs axi_ad9643/s_axi/axi_lite]
assign_bd_address -offset 0x7C400000 -range 64K -target_address_space [get_bd_addr_spaces sys_ps7/Data] [get_bd_addr_segs axi_ad9643_dma/s_axi/axi_lite]
assign_bd_address -offset 0x7C420000 -range 64K -target_address_space [get_bd_addr_spaces sys_ps7/Data] [get_bd_addr_segs axi_ad9122_dma/s_axi/axi_lite]

validate_bd_design
save_bd_design
